# EAGLE schematic ND_PCR (EAGLE 6.6.0)
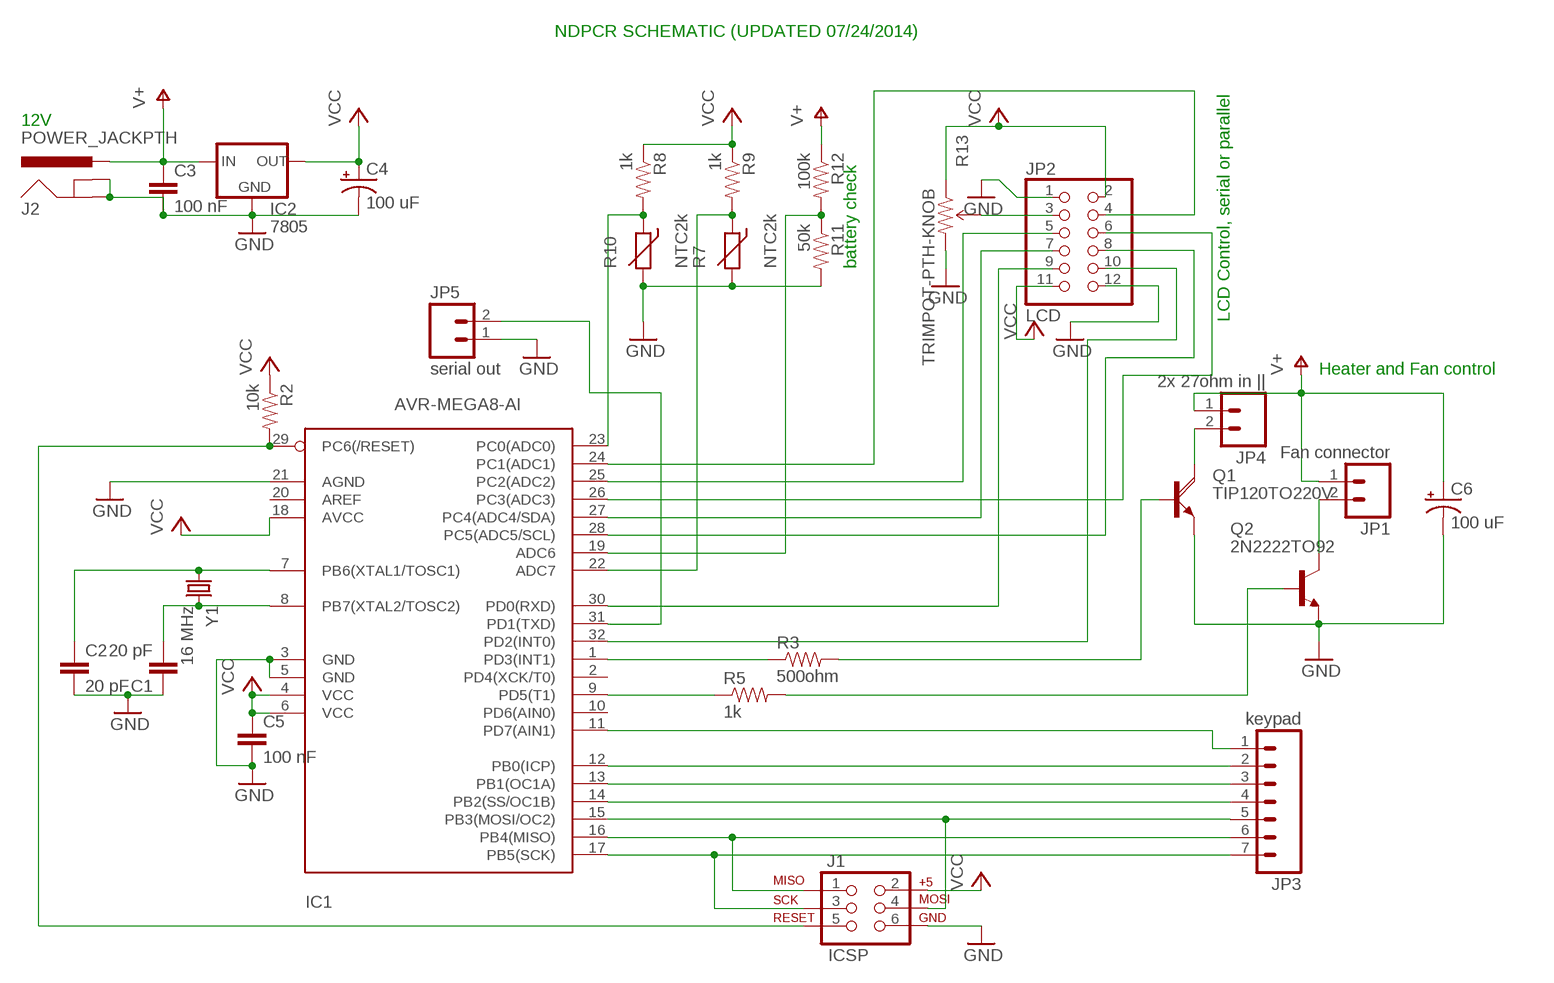
[diagram p0: schematic, sheet 1]

## Parts
C1  20 pF  CAPPTH  [CAP-PTH-SMALL]
C2  20 pF  CAPPTH  [CAP-PTH-SMALL]
C3  100 nF  CAPPTH  [CAP-PTH-SMALL]
C4  100 uF  CAP_POLPTH1  [CPOL-RADIAL-100UF-25V]
C5  100 nF  CAPPTH  [CAP-PTH-SMALL]
C6  100 uF  CAP_POLPTH1  [CPOL-RADIAL-100UF-25V]
IC1  AVR-MEGA8-AI  [TQFP32-08]
IC2  7805  78XXS  [78XXS]
J1  ICSP  AVR_SPI_PRG_6PTH  [2X3]
J2  POWER_JACKPTH  [POWER_JACK_PTH]
JP1  Fan connector  M02LOCK  [1X02_LOCK]
JP2  LCD  PINHD-2X6  [2X06]
JP3  keypad  M07  [1X07]
JP4  2x 27ohm in ||  M02LOCK  [1X02_LOCK]
JP5  serial out  M02LOCK  [1X02_LOCK]
Q1  TIP120TO220V  [TO220AV]
Q2  2N2222TO92  [TO92-EBC]
R2  10k  RESISTORPTH-1/2W  [AXIAL-0.5]
R3  500ohm  RESISTORPTH-1/2W  [AXIAL-0.5]
R5  1k  RESISTORPTH-1/2W  [AXIAL-0.5]
R7  NTC2k  THERMISTOR-2,5  [RS-2,5]
R8  1k  RESISTORPTH-1/2W  [AXIAL-0.5]
R9  1k  RESISTORPTH-1/2W  [AXIAL-0.5]
R10  NTC2k  THERMISTOR-2,5  [RS-2,5]
R11  50k  RESISTORPTH-1/2W  [AXIAL-0.5]
R12  100k  RESISTORPTH-1/2W  [AXIAL-0.5]
R13  TRIMPOT-PTH-KNOB  [3386U]
Y1  16 MHz  CRYSTALHC49US  [HC49US]

## Nets
GND: C1.1 C2.2 C3.2 C4.2(-) C5.2 C6.2(-) IC1.3(GND) IC1.5(GND) IC1.21(AGND) IC2.GND J1.6 J2.GND J2.GNDBREAK JP2.1 JP2.12 JP5.1 Q1.E Q2.C(E) R7.2 R10.2 R11.P$2 R13.3(CW)
N$1: C2.1 IC1.7(PB6(XTAL1/TOSC1)) Y1.1
N$2: C1.2 IC1.8(PB7(XTAL2/TOSC2)) Y1.2
N$3: IC1.23(PC0(ADC0)) R8.P$2 R10.1
N$4: IC1.15(PB3(MOSI/OC2)) J1.4 JP3.5
N$5: JP4.2 Q1.C
N$6: IC1.29(PC6(/RESET)) J1.5 R2.P$2
N$7: IC1.16(PB4(MISO)) J1.1 JP3.6
N$8: IC1.17(PB5(SCK)) J1.3 JP3.7
N$9: IC1.24(PC1(ADC1)) JP2.4
N$10: IC1.1(PD3(INT1)) R3.P$1
N$11: Q1.B R3.P$2
N$12: IC1.31(PD1(TXD)) JP5.2
N$13: IC1.22(ADC7) R7.1 R9.P$2
N$14: IC1.9(PD5(T1)) R5.P$1
N$15: JP1.2 Q2.E(C)
N$16: IC1.26(PC3(ADC3)) JP2.6
N$17: Q2.B R5.P$2
N$18: IC1.19(ADC6) R11.P$1 R12.P$2
N$19: JP2.3 R13.2(WIPER)
N$20: IC1.25(PC2(ADC2)) JP2.5
N$21: IC1.28(PC5(ADC5/SCL)) JP2.8
N$22: IC1.27(PC4(ADC4/SDA)) JP2.7
N$23: IC1.30(PD0(RXD)) JP2.9
N$25: IC1.32(PD2(INT0)) JP2.10
N$27: IC1.11(PD7(AIN1)) JP3.1
N$28: IC1.12(PB0(ICP)) JP3.2
N$29: IC1.13(PB1(OC1A)) JP3.3
N$30: IC1.14(PB2(SS/OC1B)) JP3.4
V+: C3.1 C6.1(+) IC2.IN J2.PWR JP1.1 JP4.1 R12.P$1
VCC: C4.1(+) C5.1 IC1.4(VCC) IC1.6(VCC) IC1.18(AVCC) IC2.OUT J1.2 JP2.2 JP2.11 R2.P$1 R8.P$1 R9.P$1 R13.1(CCW)
Unconnected: IC1.2(PD4(XCK/T0)) IC1.10(PD6(AIN0)) IC1.20(AREF)

## Notes on the sheet
- NDPCR SCHEMATIC (UPDATED 07/24/2014)
- 12V
- battery check
- LCD Control, serial or parallel
- Heater and Fan control

## Library data of the parts
C1-C3 C5 = SparkFun:CAP: Capacitor Standard 0603 ceramic capacitor, and 0.1" leaded capacitor.
C4 C6 = SparkFun:CAP_POL: Capacitor Polarized These are standard SMD and PTH capacitors. Normally 10uF, 47uF, and 100uF in electrolytic and tantalum varieties. Always verify the external diameter of the through hole cap, it varies with capacity, voltage, and manufacturer. The EIA devices should be standard.
IC1 = SparkFun:AVR-MEGA8: MICROCONTROLLER 8 Kbytes FLASH 1 kbytes SRAM 512 bytes EEPROM USART 6-channel 10 bit ADC 2-channel 8 bit ADC
IC2 = v-reg:78XXS: VOLTAGE REGULATOR
J1 = SparkFun:AVR_SPI_PRG_6: AVR ISP 6 Pin This is the reduced ISP connector for AVR programming. Common on Arduino. This footprint will take up less PCB space and can be used with a 10-pin to 6-pin adapter such as SKU: BOB-08508
J2 = SparkFun:POWER_JACK: Power Jack This is the standard 5.5mm barrel jack for power. The PTH is the most common, proven, reliable, footprint. All others are experimental. The Slot footprint only works if the mill layer is transmitted to the PCB fab house so be warned. Spark Fun Electronics SKU : PRT-00119. Mating wall wart : TOL-00298 (and others)
JP1 JP4 JP5 = SparkFun:M02: Header 2 Standard 2-pin 0.1" header. Use with straight break away headers (SKU : PRT-00116), right angle break away headers (PRT-00553), swiss pins (PRT-00743), machine pins (PRT-00117), and female headers (PRT-00115). Molex polarized connector foot print use with SKU : PRT-08233 with associated crimp pins and housings.
JP2 = pinhead:PINHD-2X6: PIN HEADER
JP3 = SparkFun:M07: Header 7 Standard 7-pin 0.1" header. Use with straight break away headers (SKU : PRT-00116), right angle break away headers (PRT-00553), swiss pins (PRT-00743), machine pins (PRT-00117), and female headers (PRT-00115). NOTES ON THE VARIANTS LOCK and LOCK_LONGPADS... This footprint was designed to help hold the alignment of a through-hole component (i.e. 7-pin header) while soldering it into place. You may notice that each hole has been shifted either up or down by 0.005 of an inch from it's more standard position (which is usually a perfectly straight line). This slight alteration caused the pins (the squares in the middle) to touch the edges of the holes. Because they are alternating, it causes a "brace" to hold the header in place. 0.005 has proven to be the perfect amount of "off-center" position when using our standard breakaway headers. Although looks a little odd when you look at the bare footprint, once you have a header in there, the alteration is very hard to notice. Also, if you push a header all the way into place, it is covered up entirely on the bottom side. This idea of altering the position of holes to aid alignment will be further integrated into the Sparkfun Library for other footprints. It can help hold any component with 3 or more connection pins.
Q1 = transistor-power:TIP120: NPN DARLINGTON TRANSISTOR
Q2 = transistor-npn:2N2222*: NPN Transistor
R2 R3 R5 R8 R9 R11 R12 = SparkFun:RESISTOR: Resistor Basic schematic elements and footprints for 0603, 1206, and PTH resistors.
R7 R10 = varistor:THERMISTOR: THERMISTOR
R13 = SparkFun:TRIMPOT
Y1 = SparkFun:CRYSTAL: Crystals Various standard crystals. Proven footprints. Spark Fun Electronics SKU : COM-00534